# Altium project Black_Valkyrie.PrjPcb
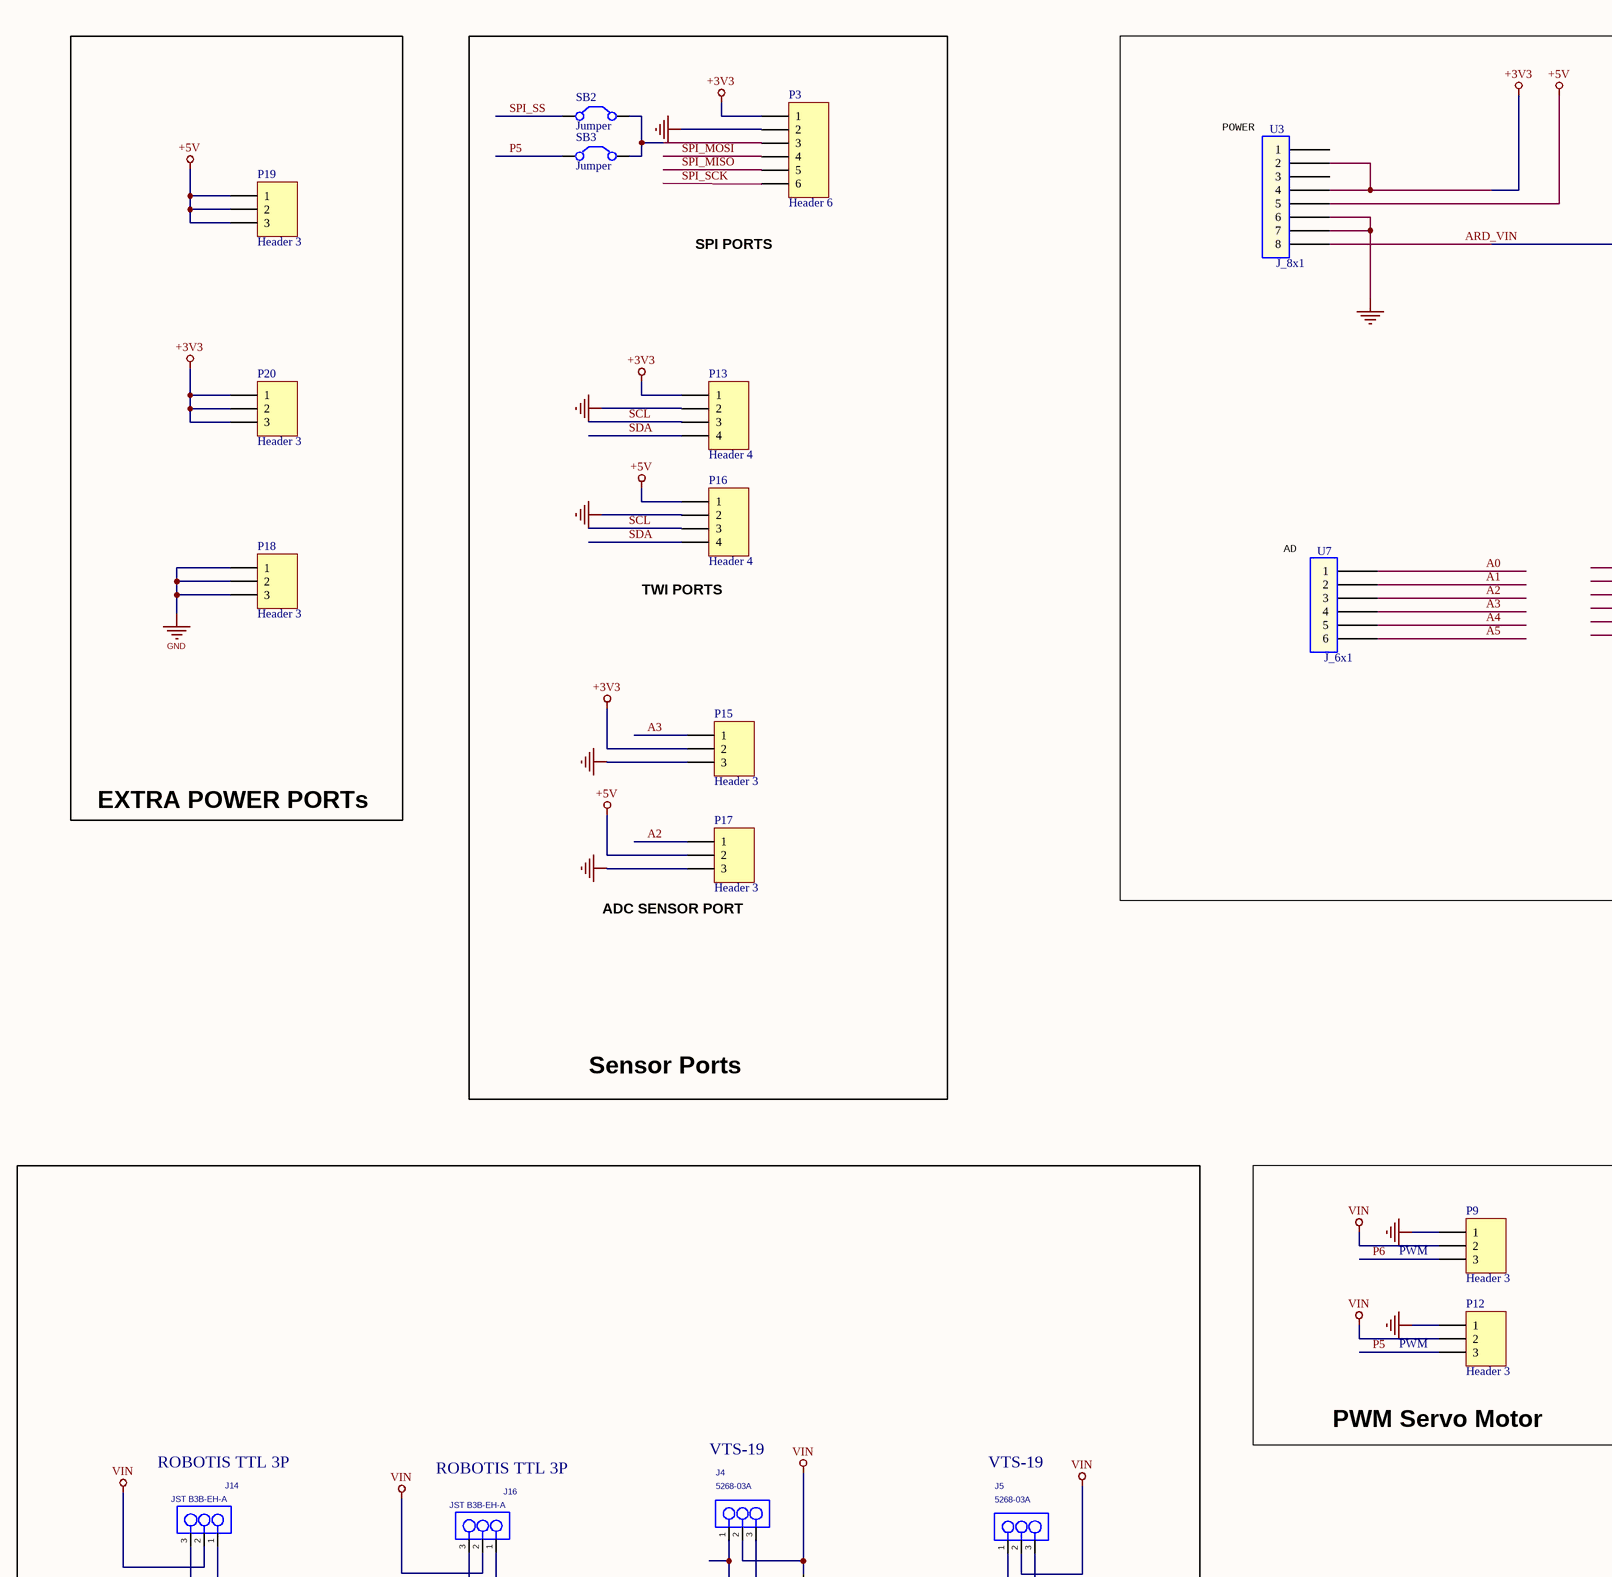
[diagram p0: Schematic.SchDoc, top left]
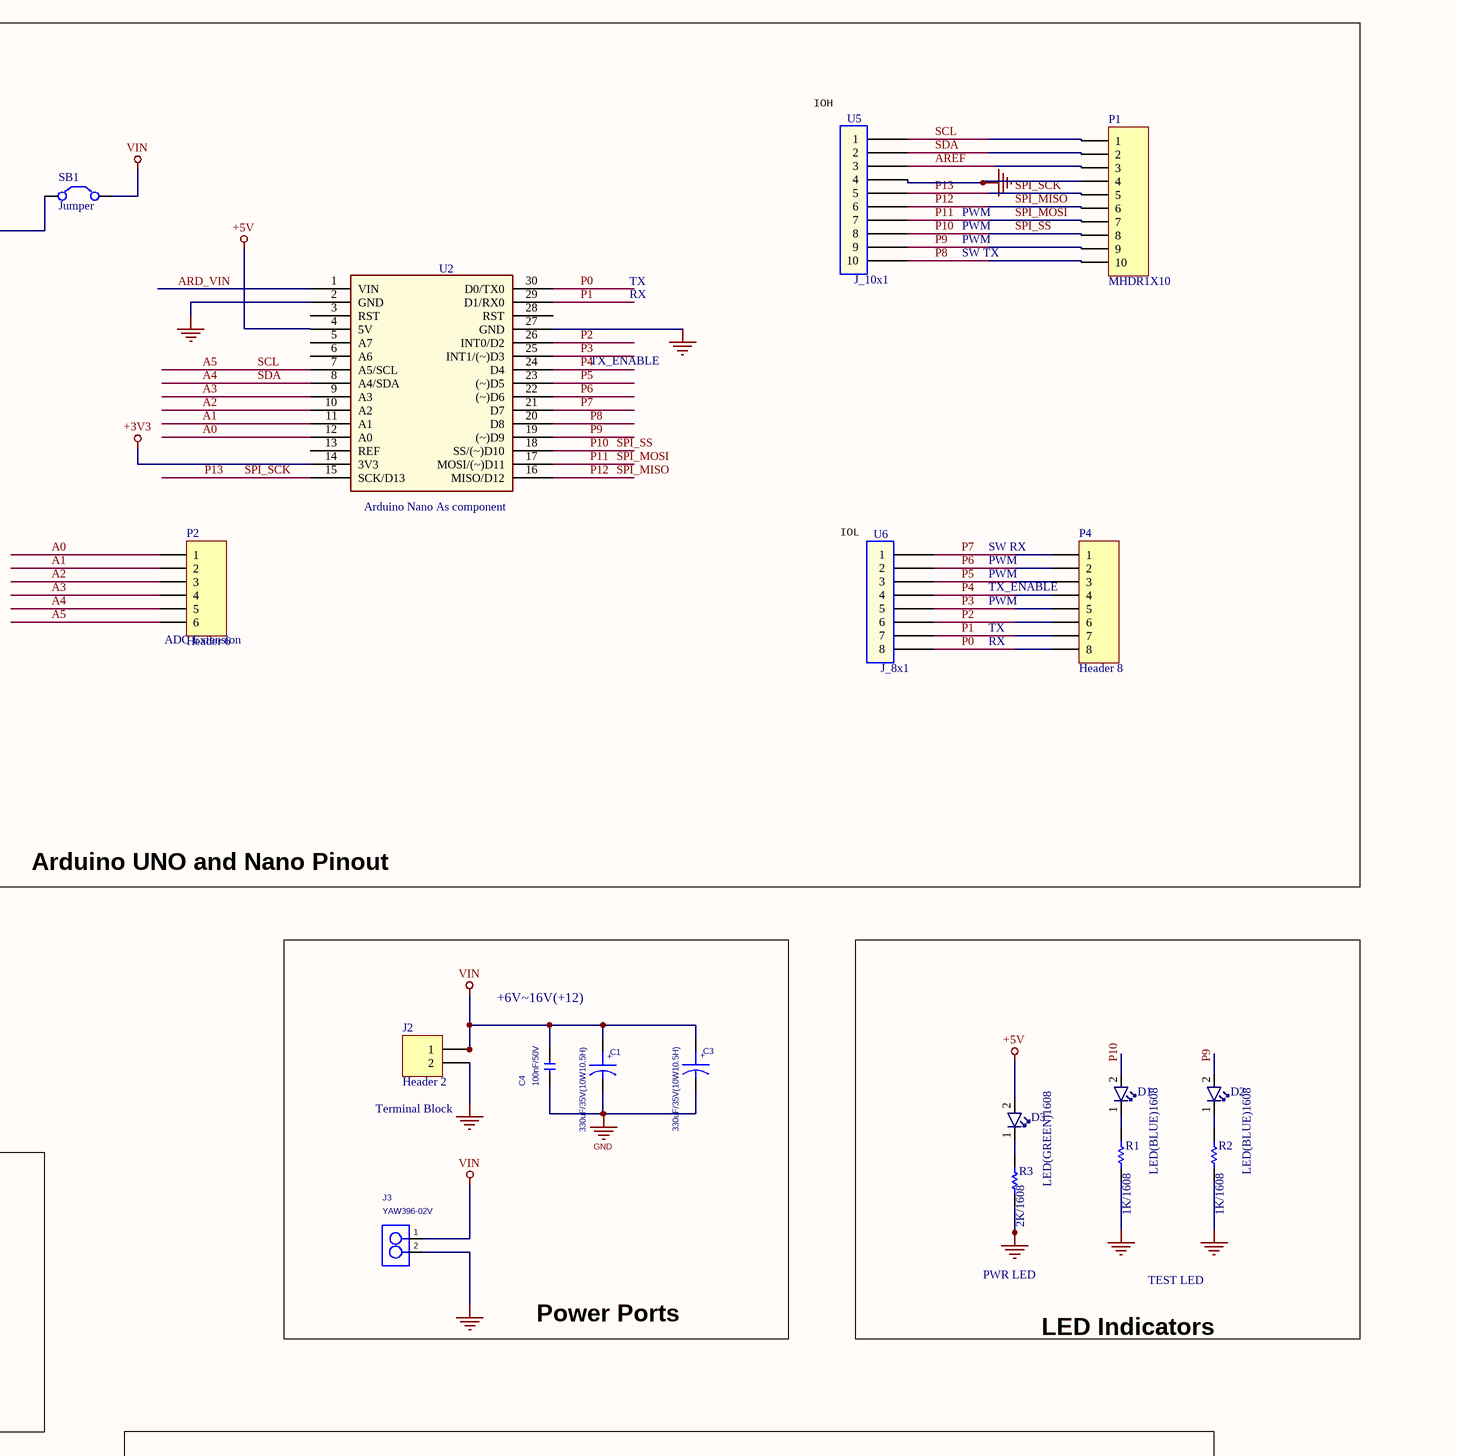
[diagram p1: Schematic.SchDoc, top middle]
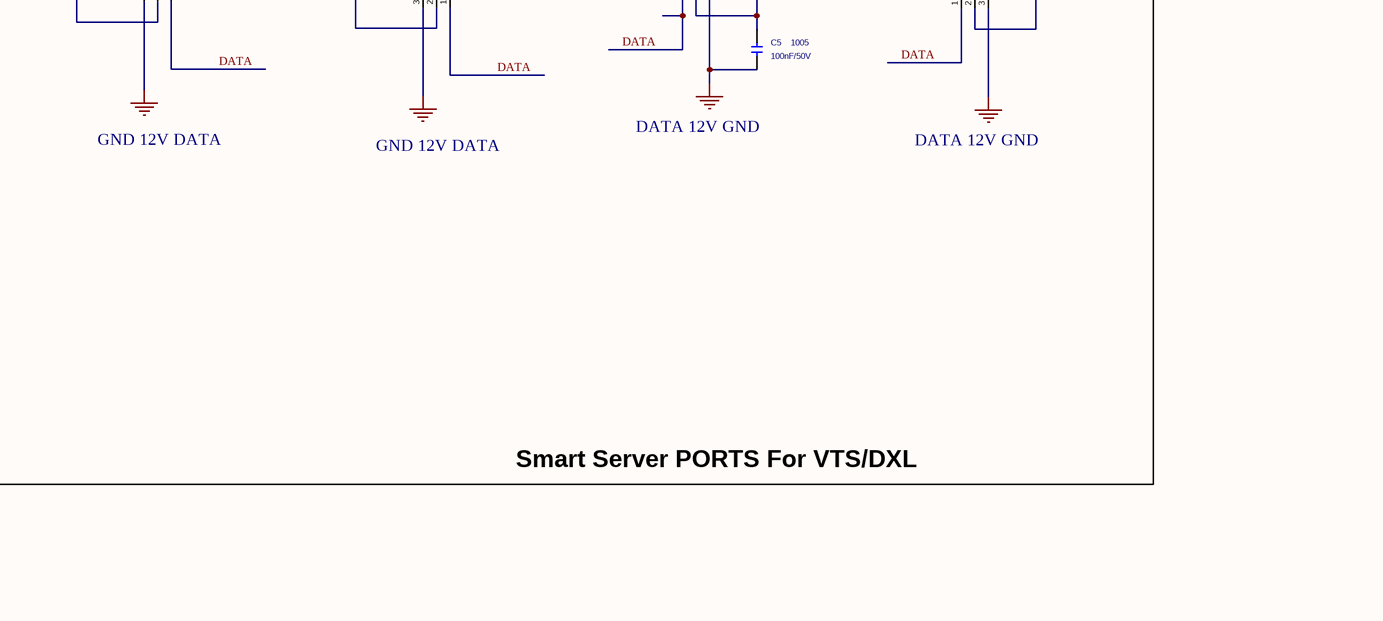
[diagram p2: Schematic.SchDoc, bottom left]
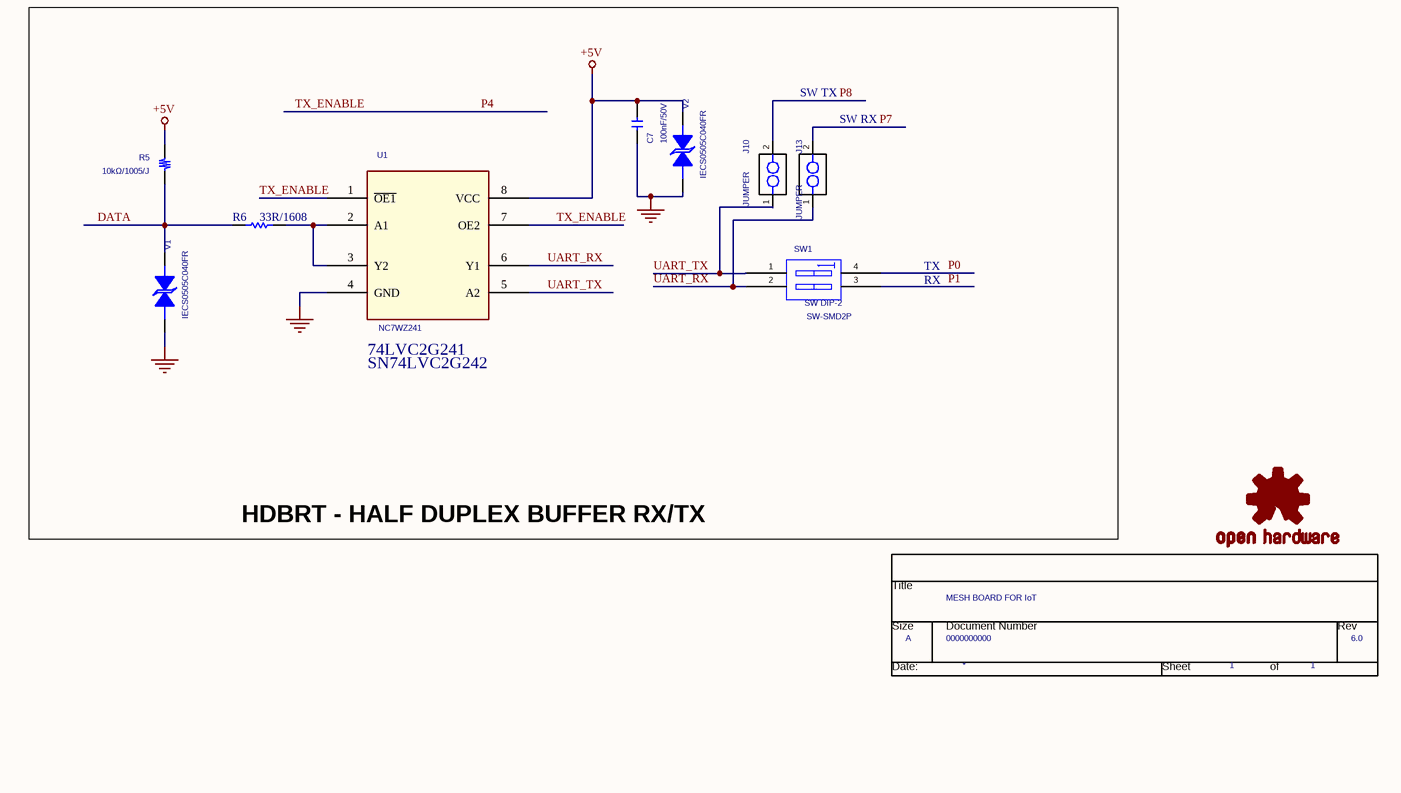
[diagram p3: Schematic.SchDoc, bottom middle]
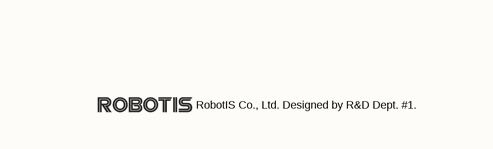
[diagram p4: Schematic.SchDoc, bottom right]
1 sheet, 48 parts. Net scope: global (net labels, ports and power ports of the same name join across sheets).
Board file: ValkyrieSHD_PCB.PcbDoc

## Sheet Schematic.SchDoc
size 594 x 420 mm

### Parts
*  Page Count: 1  Page Size: A  Title: MESH BOARD FOR IoT  RevCode: 6.0  Doc: 0000000000  (hidden comment: TitleBlock0)  (graphical)
C1  330uF/35V(10W10.5H)  [SMD-C(10.0)]
C3  330uF/35V(10W10.5H)  [SMD-C(10.0)]
C4  value 100nF/50V  [CAPC1608X06L]  (hidden comment: CAP-CHIP-2012)
C5  value 100nF/50V  size: 1005  [CAPC1608X06L]  (hidden comment: CAP-CHIP-1005)
C7  value 100nF/50V  [CAPC1608X06L]  (hidden comment: CAP-CHIP-1005)
D1  LED(BLUE)1608  [LED2012-LJS]
D2  LED(BLUE)1608  [LED2012-LJS]
D3  LED(GREEN)1608  [LED2012-LJS]
J2  Header 2  [BLOCK-5.08MMX2P]
J3  value YAW396-02V  [NW-VH3.96-2A]  (hidden comment: YAW396-02)
J4  5268-03A  [5267-03]
J5  5268-03A  [5267-03]
J10  JUMPER  [HDR1X2]
J13  JUMPER  [HDR1X2]
J14  JST B3B-EH-A  [JST_B3B-EH-A]
J16  JST B3B-EH-A  [JST_B3B-EH-A]
LOGO1  OSHW-LOGOS  (value not drawn)
P1  MHDR1X10  [HDR1X10]
P2  Header 6  [HDR1X6]
P3  Header 6  [HDR1X6]
P4  Header 8  [HDR1X8]
P9  Header 3  [HDR1X3]
P12  Header 3  [HDR1X3]
P13  Header 4  [HDR1X4]
P15  Header 3  [HDR1X3]
P16  Header 4  [HDR1X4]
P17  Header 3  [HDR1X3]
P18  Header 3  [HDR1X3]
P19  Header 3  [HDR1X3]
P20  Header 3  [HDR1X3]
R1  1K/1608  [RESC1608X06L]
R2  1K/1608  [RESC1608X06L]
R3  2K/1608  [RESC1608X06L]
R5  value 10kΩ/1005/J  [RESC1608X06L]  (hidden comment: RES-CHIP-1005)
R6  33R/1608  [RESC1608X06L]
SB1  Jumper  [Solderbridge_3pi]
SB2  Jumper  [Solderbridge]
SB3  Jumper  [Solderbridge_Shorted]
SW1  value SW DIP-2  [SW-SMD2P]  (hidden comment: SW_DIP-2_0)
U1  NC7WZ241  [MO-187_0.5_2.0X3.1]
U2  Arduino Nano As component  [Arduino_Nano_Board]
U3  J_8x1  [J_8x1]
U5  J_10x1  [J_10x1]
U6  J_8x1  [J_8x1]
U7  J_6x1  [J_6x1]
V1  IECS0505C040FR  [RESC1608X06L]
V2  IECS0505C040FR  [RESC1608X06L]

### Blocks framed on the sheet
+6V~16V(+12): C1 C3 C4 J2 J3

### Nets
+3V3: P3.1 P13.1 P15.2 P20.1 P20.2 P20.3 U2.14(3V3) U3.2 U3.4
+5V: C7.2 D3.2(A) P16.1 P17.2 P19.1 P19.2 P19.3 R5.2 U1.8(VCC) U2.4(5V) U3.5 V2.2(CATHODE)
GND: C1.2 C3.2 C4.1 C5.1 C7.1 J2.2 J3.2 J4.3 J5.3 J14.3 J16.3 P1.4 P3.2 P9.1 P12.1 P13.2 P15.3 P16.2 P17.3 P18.1 P18.2 P18.3 R1.1 R2.1 R3.1 U1.4(GND) U2.2(GND) U2.27(GND) U3.6 U3.7 U5.4 V1.1(ANODE) V2.1(ANODE)
VIN: C1.1 C3.1 C4.2 C5.2 J2.1 J3.1 J4.2 J5.2 J14.2 J16.2 P9.2 P12.2 SB1.2(C2)
A0: P2.1 U2.12(A0) U7.1
A1: P2.2 U2.11(A1) U7.2
A2: P2.3 P17.1 U2.10(A2) U7.3
A3: P2.4 P15.1 U2.9(A3) U7.4
A4: P1.2 P2.5 P13.4 P16.4 U2.8(A4/SDA) U5.2 U7.5  [also labelled SDA]
A5: P1.1 P2.6 P13.3 P16.3 U2.7(A5/SCL) U5.1 U7.6  [also labelled SCL]
ARD_VIN: SB1.1(C1) U2.1(VIN) U3.8
AREF: P1.3 U5.3
DATA: J4.1 J5.1 J14.1 J16.1 R5.1 R6.2 V1.2(CATHODE)
P0: P4.8 SW1.4(B1) U2.30(D0/TX0) U6.8
P1: P4.7 SW1.3(B2) U2.29(D1/RX0) U6.7
P2: P4.6 U2.26(INT0/D2) U6.6
P3: P4.5 U2.25(INT1/(~)D3) U6.5
P4: P4.4 U1.1(~{OE1}) U1.7(OE2) U2.24(D4) U6.4  [also labelled TX_ENABLE]
P5: P4.3 P12.3 SB3.1(C1) U2.23((~)D5) U6.3
P6: P4.2 P9.3 U2.22((~)D6) U6.2
P7: J13.2 P4.1 U2.21(D7) U6.1
P8: J10.2 P1.10 U2.20(D8) U5.10
P9: D2.2(A) P1.9 U2.19((~)D9) U5.9
P10: D1.2(A) P1.8 SB2.1(C1) U2.18(SS/(~)D10) U5.8  [also labelled SPI_SS]
P11: P1.7 P3.4 U2.17(MOSI/(~)D11) U5.7  [also labelled SPI_MOSI]
P12: P1.6 P3.5 U2.16(MISO/D12) U5.6  [also labelled SPI_MISO]
P13: P1.5 P3.6 U2.15(SCK/D13) U5.5  [also labelled SPI_SCK]
UART_RX: J13.1 SW1.2(A2) U1.6(Y1)
UART_TX: J10.1 SW1.1(A1) U1.5(A2)
NetD1_1: D1.1(C) R1.2
NetD2_1: D2.1(C) R2.2
NetD3_1: D3.1(C) R3.2
NetP3_3: P3.3 SB2.2(C2) SB3.2(C2)
NetR6_1: R6.1 U1.2(A1) U1.3(Y2)

Not connected (* = marked no-connect by the designer): U2 3(RST) 5(A7) 6(A6) 13(REF) 28(RST); U3 1 3

### Notes on the sheet
- (near U5) IOH
- (near U3) POWER
- PWM
- (near P3) SPI PORTS
- RX
- TX
- SW TX
- TX_ENABLE
- (near U7) AD
- (near U6) IOL
- SW RX
- (near P16) TWI PORTS
- (near P2) ADC Extension
- (near P4) TX_ENABLE
- EXTRA POWER PORTs
- (near P17) ADC SENSOR PORT
- Arduino UNO and Nano Pinout
- Sensor Ports
- (near J2) Terminal Block
- (near P9) PWM
- Power Ports
- PWR LED
- TEST LED
- (near P12) PWM
- LED Indicators
- ROBOTIS TTL 3P
- VTS-19
- (near P12) PWM Servo Motor
- (near J13) SW RX
- DATA 12V GND
- GND 12V DATA
- (near U1) 74LVC2G241
- SN74LVC2G242
- (near *) HDBRT - HALF DUPLEX BUFFER RX/TX
- Smart Server PORTS For VTS/DXL
- RobotIS Co., Ltd. Designed by R&D Dept. #1.
- (in symbol C_10/16) +
- (in symbol TitleBlock0) Title; Size; Document Number; Rev; Date:; Sheet; of

### Library data of the parts
C1 C3 = C_10/16: PCB PartLoc: MM,59.125,55,90,1; PCB RefLoc: MM,7.625,-5.625,180,CC,1.2,1,0.12,std,1; Value: 330uF/35V(10W10.5H)
C4 = CAP-CHIP-2012: PCB DECAL: 1005; size: 1005
C7 = CAP-CHIP-1005: PCB DECAL: 1005; size: 1005
D1-D3 = D:LED: LED SMARTLED GREEN 570NM 0603
  D1 D2: Value: LED(BLUE)1608
  D3: Value: LED(GREEN)1608
J2 = Header 2: Header, 2-Pin; LatestRevisionDate: 17-Jul-2002; LatestRevisionNote: Re-released for DXP Platform.; Publisher: Altium Limited
J10 J13 = JUMPER_2P: PCB DECAL: 5267-03
J14 J16 = 5268-03A: Value: JST B3B-EH-A
LOGO1 = OSHW-LOGOS: Open Source Hardware Logo This logo indicates the piece of hardware it is found on incorporates a OSHW license and/or adheres to the definition of open source hardware found here: http://freedomdefined.org/OSHW
P1 = MHDR1X10: Header, 10-Pin; LatestRevisionDate: 17-Jul-2002; LatestRevisionNote: Re-released for DXP Platform.; Publisher: Altium Limited
P2 P3 = Header 6: Header, 6-Pin; LatestRevisionDate: 17-Jul-2002; LatestRevisionNote: Re-released for DXP Platform.; Publisher: Altium Limited
P4 = Header 8: Header, 8-Pin; LatestRevisionDate: 17-Jul-2002; LatestRevisionNote: Re-released for DXP Platform.; Publisher: Altium Limited
P9 P12 P15 P17-P20 = Header 3: Header, 3-Pin; LatestRevisionDate: 17-Jul-2002; LatestRevisionNote: Re-released for DXP Platform.; Publisher: Altium Limited
P13 P16 = Header 4: Header, 4-Pin; LatestRevisionDate: 17-Jul-2002; LatestRevisionNote: Re-released for DXP Platform.; Publisher: Altium Limited
R1-R3 R6 = RES_0603: Not mounted
  R1 R2: Value: 1K/1608
  R3: Value: 2K/1608
  R6: Value: 33R/1608
R5 = RES-CHIP-1005: PCB DECAL: 1005; size: 1005
SB1-SB3 = Jumper: Jumper Wire; Published: 24-Mar-1999; LatestRevisionDate: 17-Jul-2002; LatestRevisionNote: Re-released for DXP Platform.; PackageReference: RAD-0.2; Publisher: Altium Limited; PackageDescription: Radial Cap, Thru-Hole; 2 Leads; 0.2 in Pin Spacing
SW1 = SW_DIP-2_0: Source_Path: \\192.168.10.135\STAFF2\I13-0002_EM-IMX6\TRUNK\HW\SCH\EM-IMX6-CORE-V10R0(130225).DSN; PCB DECAL: SW-SMD2P
U2 = ArduinoNano
V1 V2 = DIODE TVS_1
* = TitleBlock0: Page Number: 1; Page Create Date: March  8, 1995; Page Modify Date: *
C5 = CAP-CHIP-1005: PCB DECAL: 1005
J3 = YAW396-02: PCB DECAL: YAW396-02V
J4 J5 = 5268-03A: Value: 5268-03A
U1 = NC7WZ241: Value: NC7WZ241
U3 U6 = J_8x1: PCB Footprint: J_8x1
U5 = J_10x1: PCB Footprint: J_10x1
U7 = J_6x1: PCB Footprint: J_6x1